# Altium schematic sheet FC_Rev1.0.SchDoc
size A3
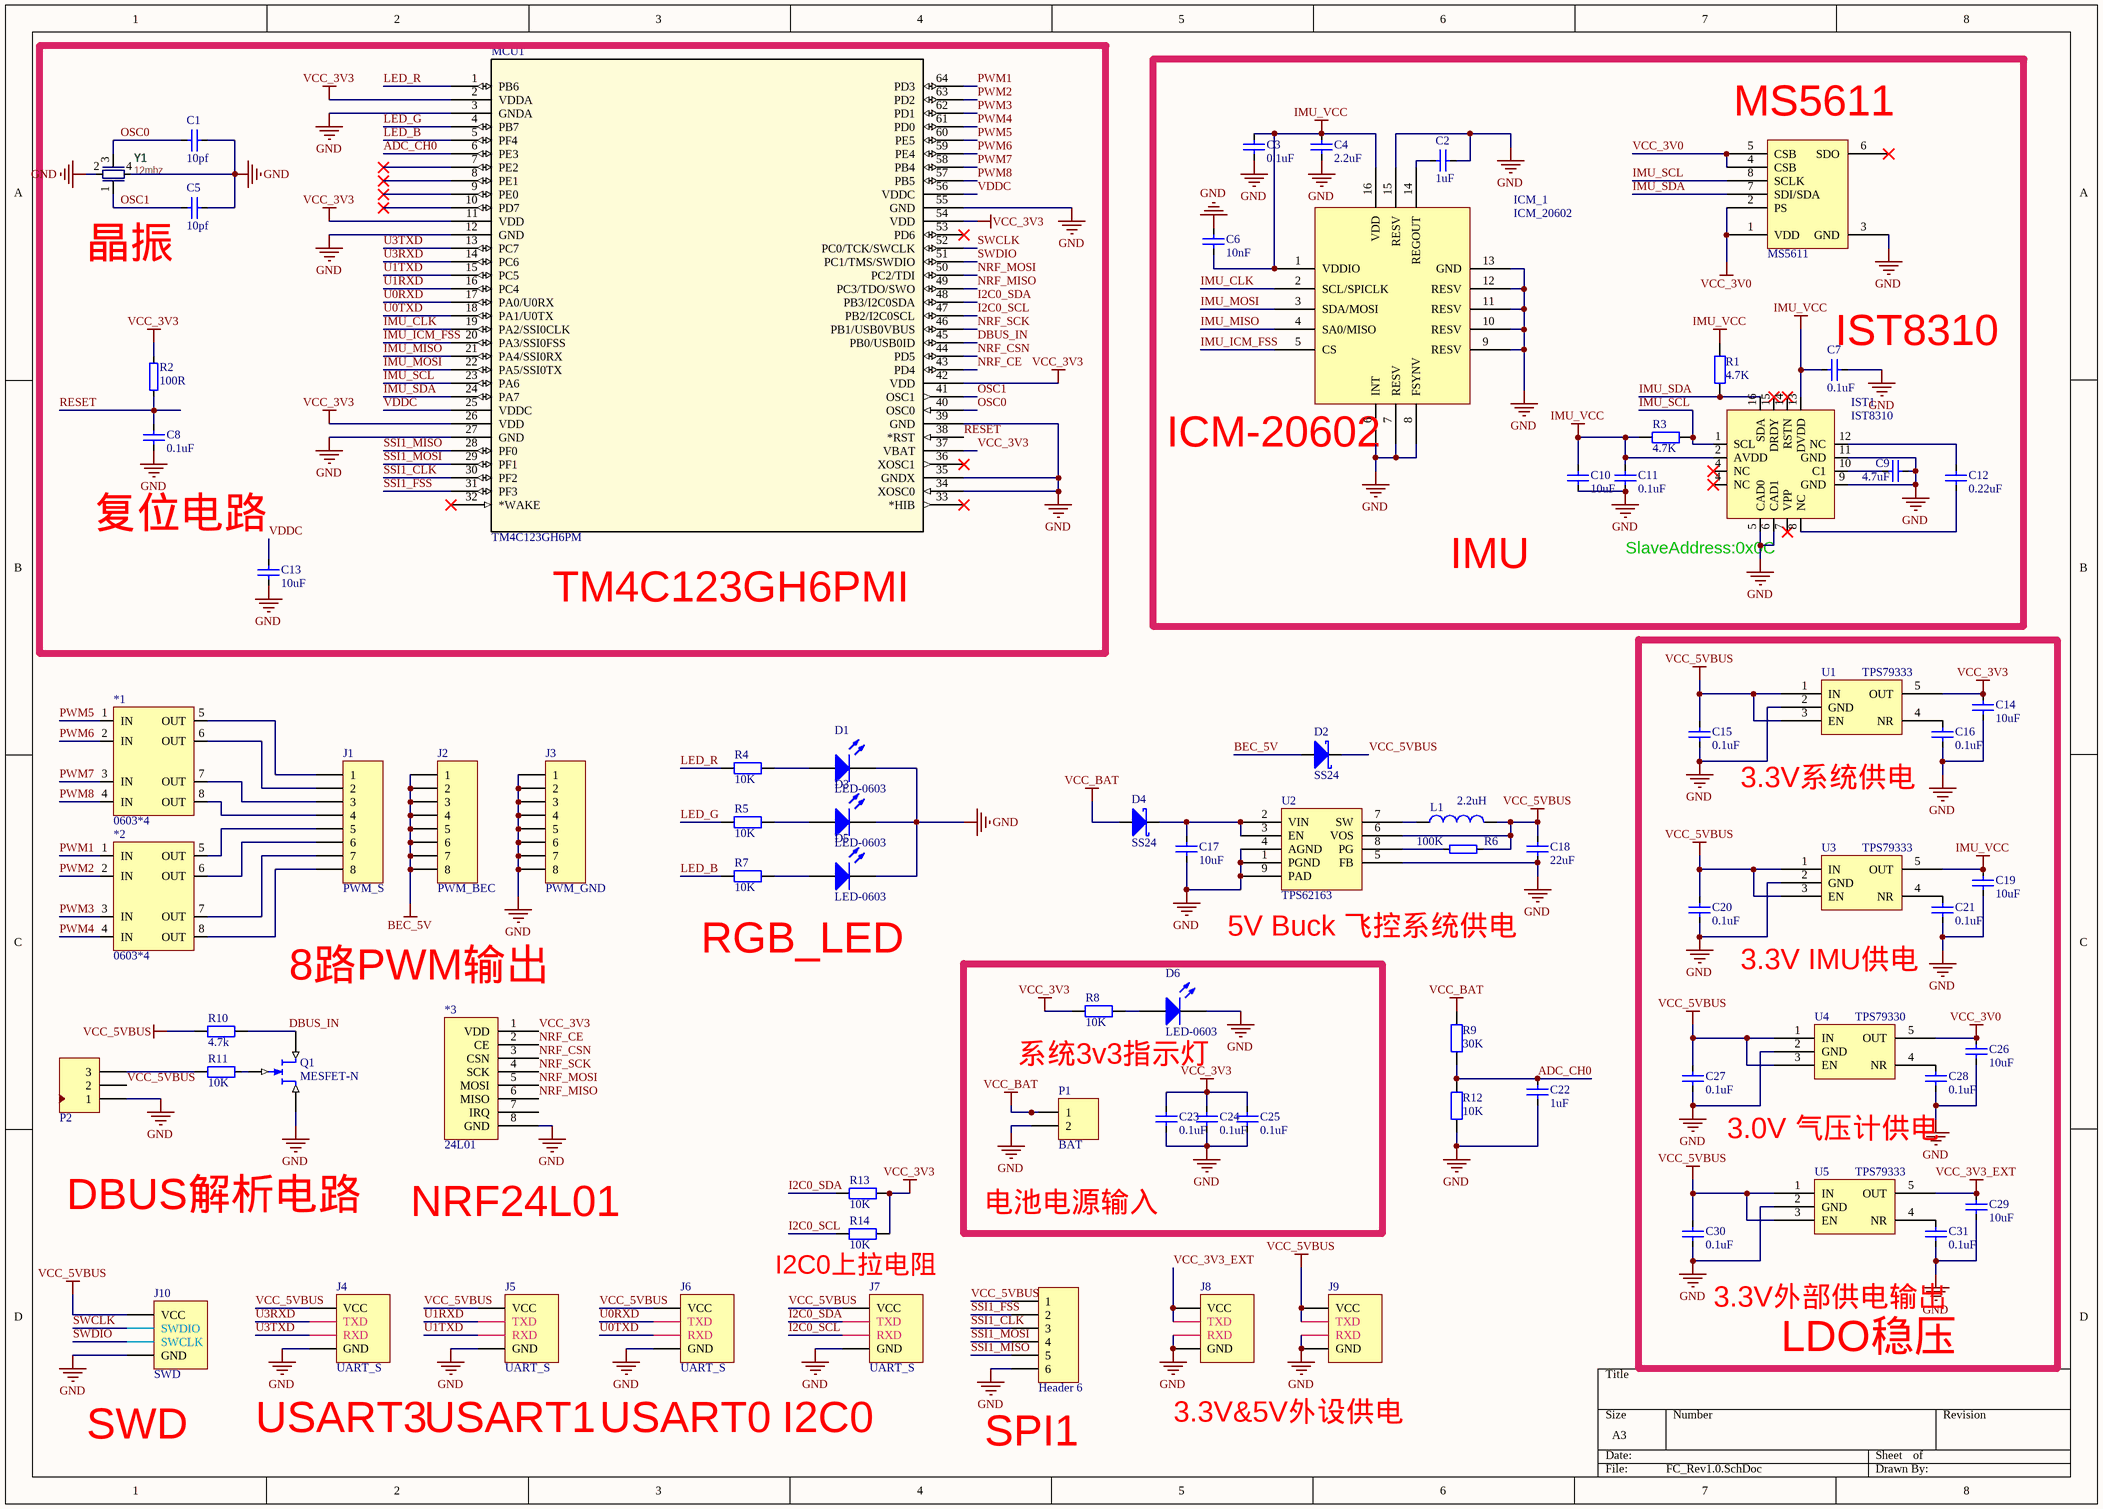
[diagram p0: FC_Rev1.0.SchDoc]

## Parts
*1  0603*4  [0603*4排阻]
*2  0603*4  [0603*4排阻]
*3  24L01  [2.4GModule]
?  Header 6  [SMT1.25_6P-90]
C1  value 10pf  [CAP_0603]  (hidden comment: Cap_0603)
C2  value 1uF  [CAP_0603]  (hidden comment: Cap_0603)
C3  value 0.1uF  [CAP_0603]  (hidden comment: Cap_0603)
C4  value 2.2uF  [CAP_0603]  (hidden comment: Cap_0603)
C5  value 10pf  [CAP_0603]  (hidden comment: Cap_0603)
C6  value 10nF  [CAP_0603]  (hidden comment: Cap_0603)
C7  value 0.1uF  [CAP_0603]  (hidden comment: Cap_0603)
C8  value 0.1uF  [CAP_0603]  (hidden comment: Cap_0603)
C9  value 4.7uF  [CAP_0603]  (hidden comment: Cap_0603)
C10  value 10uF  [CAP_0603]  (hidden comment: Cap_0603)
C11  value 0.1uF  [CAP_0603]  (hidden comment: Cap_0603)
C12  value 0.22uF  [CAP_0603]  (hidden comment: Cap_0603)
C13  value 10uF  [CAP_0603]  (hidden comment: Cap_0603)
C14  value 10uF  [CAP_0603]  (hidden comment: Cap_0603)
C15  value 0.1uF  [CAP_0603]  (hidden comment: Cap_0603)
C16  value 0.1uF  [CAP_0603]  (hidden comment: Cap_0603)
C17  value 10uF  [CAP_0805]  (hidden comment: Cap_0603)
C18  value 22uF  [1206-C]  (hidden comment: Cap_0603)
C19  value 10uF  [CAP_0603]  (hidden comment: Cap_0603)
C20  value 0.1uF  [CAP_0603]  (hidden comment: Cap_0603)
C21  value 0.1uF  [CAP_0603]  (hidden comment: Cap_0603)
C22  value 1uF  [CAP_0603]  (hidden comment: Cap_0603)
C23  value 0.1uF  [CAP_0603]  (hidden comment: Cap_0603)
C24  value 0.1uF  [CAP_0603]  (hidden comment: Cap_0603)
C25  value 0.1uF  [CAP_0603]  (hidden comment: Cap_0603)
C26  value 10uF  [CAP_0603]  (hidden comment: Cap_0603)
C27  value 0.1uF  [CAP_0603]  (hidden comment: Cap_0603)
C28  value 0.1uF  [CAP_0603]  (hidden comment: Cap_0603)
C29  value 10uF  [CAP_0603]  (hidden comment: Cap_0603)
C30  value 0.1uF  [CAP_0603]  (hidden comment: Cap_0603)
C31  value 0.1uF  [CAP_0603]  (hidden comment: Cap_0603)
D1  LED-0603  [LED_0603_RED]
D2  SS24  [DIODE-1206]
D3  LED-0603  [LED_0603_RED]
D4  SS24  [DIODE-1206]
D5  LED-0603  [LED_0603_RED]
D6  LED-0603  [LED_0603_RED]
ICM_1  ICM_20602  [LGA16]
IST1  IST8310  [HMC5983-new]
J1  PWM_S  [HDR1X8]
J2  PWM_BEC  [HDR1X8]
J3  PWM_GND  [HDR1X8]
J4  UART_S  [SMT1.25_4P-90]
J5  UART_S  [SMT1.25_4P-90]
J6  UART_S  [SMT1.25_4P-90]
J7  UART_S  [SMT1.25_4P-90]
J8  (no value)  [SMT1.25_4P-90]
J9  (no value)  [SMT1.25_4P-90]
J10  SWD  [SMT1.25_4P-90]
L1  2.2uH  [2R2_5*5]
MCU1  TM4C123GH6PM  [LQFP64]
MS1  MS5611  [MS5611]
P1  BAT  [HDR1X2]
P2  Header 3  [HDR3X1-2.54]  (value not drawn)
Q1  MESFET-N  [SOT23]
R1  value 4.7K  [0603-R]  (hidden comment: Res_0603)
R2  100R  [0603-R]
R3  value 4.7K  [0603-R]  (hidden comment: Res_0603)
R4  value 10K  [0603-R]  (hidden comment: Res_0603)
R5  value 10K  [0603-R]  (hidden comment: Res_0603)
R6  100K  [0603-R]
R7  value 10K  [0603-R]  (hidden comment: Res_0603)
R8  value 10K  [0603-R]  (hidden comment: Res_0603)
R9  value 30K  [0603-R]  (hidden comment: Res_0603)
R10  value 4.7k  [0603-R]  (hidden comment: Res_0603)
R11  value 10K  [0603-R]  (hidden comment: Res_0603)
R12  value 10K  [0603-R]  (hidden comment: Res_0603)
R13  value 10K  [0603-R]  (hidden comment: Res_0603)
R14  value 10K  [0603-R]  (hidden comment: Res_0603)
U1  TPS79333  [SOT23-5]
U2  TPS62163  [TPS62163DSG]
U3  TPS79333  [SOT23-5]
U4  TPS79330  [SOT23-5]
U5  TPS79333  [SOT23-5]
Y1  12mhz  [3225_new]

## Blocks framed on the sheet
LDO稳压: C14-C16 C19-C21 C26-C31 U1 U3-U5

## Nets
BEC_5V: D2.1(A) J2.1 J2.2 J2.3 J2.4 J2.5 J2.6 J2.7 J2.8
GND: *3.8(GND) ?.6 C1.2 C2.2 C3.2 C4.1 C5.2 C6.2 C7.1 C8.1 C9.1 C10.1 C11.1 C13.1 C14.1 C15.1 C16.1 C17.1 C18.1 C19.1 C20.1 C21.1 C22.1 C23.1 C24.1 C25.1 C26.1 C27.1 C28.1 C29.1 C30.1 C31.1 D1.2(K) D3.2(K) D5.2(K) D6.2(K) ICM_1.6(INT) ICM_1.7(RESV) ICM_1.8(FSYNV) ICM_1.9(RESV) ICM_1.10(RESV) ICM_1.11(RESV) ICM_1.12(RESV) ICM_1.13(GND) ICM_1.15(RESV) IST1.5(CAD0) IST1.6(CAD1) IST1.9(GND) IST1.11(GND) J3.1 J3.2 J3.3 J3.4 J3.5 J3.6 J3.7 J3.8 J4.4(GND) J5.4(GND) J6.4(GND) J7.4(GND) J8.3(RXD) J8.4(GND) J9.3(RXD) J9.4(GND) J10.4(GND) MCU1.3(GNDA) MCU1.12(GND) MCU1.27(GND) MCU1.34(XOSC0) MCU1.35(GNDX) MCU1.39(GND) MCU1.55(GND) MS1.3(GND) P1.2 P2.1 Q1.3(S) R12.1 U1.2(GND) U2.1(PGND) U2.4(AGND) U2.5(FB) U2.9(PAD) U3.2(GND) U4.2(GND) U5.2(GND) Y1.2 Y1.4
IMU_VCC: C3.1 C4.2 C6.1 C7.2 C10.2 C11.2 C19.2 ICM_1.1(VDDIO) ICM_1.16(VDD) IST1.2(AVDD) IST1.13(DVDD) R1.2 R3.1 U3.5(OUT)
VCC_3V0: C26.2 MS1.1(VDD) MS1.2(PS) MS1.4(CSB) MS1.5(CSB) U4.5(OUT)
VCC_3V3: *3.1(VDD) C14.2 C23.2 C24.2 C25.2 MCU1.2(VDDA) MCU1.11(VDD) MCU1.26(VDD) MCU1.37(VBAT) MCU1.42(VDD) MCU1.54(VDD) R2.2 R8.1 R13.2 R14.2 U1.5(OUT)
VCC_3V3_EXT: C29.2 J8.1(VCC) J8.2(TXD) U5.5(OUT)
VCC_5VBUS: ?.1 C15.2 C18.2 C20.2 C27.2 C30.2 D2.2(K) J4.1(VCC) J5.1(VCC) J6.1(VCC) J7.1(VCC) J9.1(VCC) J9.2(TXD) J10.1(VCC) L1.2 P2.2 R6.2 R10.2 U1.1(IN) U1.3(EN) U2.6(VOS) U3.1(IN) U3.3(EN) U4.1(IN) U4.3(EN) U5.1(IN) U5.3(EN)
VCC_BAT: D4.1(A) P1.1 R9.2
ADC_CH0: C22.2 MCU1.6(PE3) R9.1 R12.2
DBUS_IN: MCU1.45(PB0/USB0ID) Q1.1(D) R10.1
I2C0_SCL: J7.3(RXD) MCU1.47(PB2/I2C0SCL) R14.1
I2C0_SDA: J7.2(TXD) MCU1.48(PB3/I2C0SDA) R13.1
IMU_CLK: ICM_1.2(SCL/SPICLK) MCU1.19(PA2/SSI0CLK)
IMU_ICM_FSS: ICM_1.5(CS) MCU1.20(PA3/SSI0FSS)
IMU_MISO: ICM_1.4(SA0/MISO) MCU1.21(PA4/SSI0RX)
IMU_MOSI: ICM_1.3(SDA/MOSI) MCU1.22(PA5/SSI0TX)
IMU_SCL: IST1.1(SCL) MCU1.23(PA6) MS1.8(SCLK) R3.2
IMU_SDA: IST1.16(SDA) MCU1.24(PA7) MS1.7(SDI/SDA) R1.1
LED_B: MCU1.5(PF4) R7.1
LED_G: MCU1.4(PB7) R5.1
LED_R: MCU1.1(PB6) R4.1
NRF_CE: *3.2(CE) MCU1.43(PD4)
NRF_CSN: *3.3(CSN) MCU1.44(PD5)
NRF_MISO: *3.6(MISO) MCU1.49(PC3/TDO/SWO)
NRF_MOSI: *3.5(MOSI) MCU1.50(PC2/TDI)
NRF_SCK: *3.4(SCK) MCU1.46(PB1/USB0VBUS)
OSC0: C1.1 MCU1.40(OSC0) Y1.3
OSC1: C5.1 MCU1.41(OSC1) Y1.1
PWM1: *2.1(IN) MCU1.64(PD3)
PWM2: *2.2(IN) MCU1.63(PD2)
PWM3: *2.3(IN) MCU1.62(PD1)
PWM4: *2.4(IN) MCU1.61(PD0)
PWM5: *1.1(IN) MCU1.60(PE5)
PWM6: *1.2(IN) MCU1.59(PE4)
PWM7: *1.3(IN) MCU1.58(PB4)
PWM8: *1.4(IN) MCU1.57(PB5)
RESET: C8.2 MCU1.38(*RST) R2.1
SSI1_CLK: ?.3 MCU1.30(PF2)
SSI1_FSS: ?.2 MCU1.31(PF3)
SSI1_MISO: ?.5 MCU1.28(PF0)
SSI1_MOSI: ?.4 MCU1.29(PF1)
SWCLK: J10.2(SWDIO) MCU1.52(PC0/TCK/SWCLK)
SWDIO: J10.3(SWCLK) MCU1.51(PC1/TMS/SWDIO)
U0RXD: J6.2(TXD) MCU1.17(PA0/U0RX)
U0TXD: J6.3(RXD) MCU1.18(PA1/U0TX)
U1RXD: J5.2(TXD) MCU1.16(PC4)
U1TXD: J5.3(RXD) MCU1.15(PC5)
U3RXD: J4.2(TXD) MCU1.14(PC6)
U3TXD: J4.3(RXD) MCU1.13(PC7)
VDDC: C13.2 MCU1.25(VDDC) MCU1.56(VDDC)
Net*1_5: *1.5(OUT) J1.1
Net*1_6: *1.6(OUT) J1.2
Net*1_7: *1.7(OUT) J1.3
Net*1_8: *1.8(OUT) J1.4
Net*2_5: *2.5(OUT) J1.5
Net*2_6: *2.6(OUT) J1.6
Net*2_7: *2.7(OUT) J1.7
Net*2_8: *2.8(OUT) J1.8
NetC2_1: C2.1 ICM_1.14(REGOUT)
NetC9_2: C9.2 IST1.10(C1)
NetC12_1: C12.1 IST1.8(NC)
NetC12_2: C12.2 IST1.12(NC)
NetC16_2: C16.2 U1.4(NR)
NetC17_2: C17.2 D4.2(K) U2.2(VIN) U2.3(EN)
NetC21_2: C21.2 U3.4(NR)
NetC28_2: C28.2 U4.4(NR)
NetC31_2: C31.2 U5.4(NR)
NetD1_1: D1.1(A) R4.2
NetD3_1: D3.1(A) R5.2
NetD5_1: D5.1(A) R7.2
NetD6_1: D6.1(A) R8.2
NetL1_1: L1.1 U2.7(SW)
NetP2_3: P2.3 R11.1
NetQ1_2: Q1.2(G) R11.2
NetR6_1: R6.1 U2.8(PG)

Not connected (* = marked no-connect by the designer): *3 7(IRQ); IST1 4(NC)* 7(VPP)* 14(RSTN)* 15(DRDY)*; MCU1 7(PE2)* 8(PE1)* 9(PE0)* 10(PD7)* 32(*WAKE)* 33(*HIB)* 36(XOSC1)* 53(PD6)*; MS1 6(SDO)*

## Notes on the sheet
- (near MS1) MS5611
- 晶振
- (near C7) IST8310
- (near ICM_1) ICM-20602
- (near C8) 复位电路
- IMU
- (near IST1) SlaveAddress:0x0C
- TM4C123GH6PMI
- 3.3V系统供电
- 8路PWM输出
- RGB_LED
- (near U2) 5V Buck 飞控系统供电
- 3.3V IMU供电
- 系统3v3指示灯
- 3.0V 气压计供电
- DBUS解析电路
- NRF24L01
- 电池电源输入
- I2C0上拉电阻
- 3.3V外部供电输出
- (near J10) SWD
- (near J4) USART3
- (near J5) USART1
- (near J6) USART0
- (near J7) I2C0
- SPI1
- 3.3V&5V外设供电

## Library data of the parts
*1 *2 = 0603*4: 0603排阻
? = Header 6: Header, 6-Pin; LatestRevisionDate: 17-Jul-2002; LatestRevisionNote: Re-released for DXP Platform.; Publisher: Altium Limited
C1-C31 = Cap_0603: Capacitor
D2 D4 = SS24: 1N5819,Low-power general purpose voltageregulator diodes in a small plasticSMD SOD323 package; Value: SS24
J1-J3 = Header 8: Header, 8-Pin; LatestRevisionDate: 17-Jul-2002; LatestRevisionNote: Re-released for DXP Platform.; Publisher: Altium Limited
J4-J9 = UART_S: UART,SerialPort,TTL,SLAVE; LatestRevisionDate: 17-Jul-2002; LatestRevisionNote: Re-released for DXP Platform.; Publisher: Altium Limited
J10 = SWD: JLINK,SWD; LatestRevisionDate: 17-Jul-2002; LatestRevisionNote: Re-released for DXP Platform.; Publisher: Altium Limited
L1 = Inductor
P1 = Header 2: Header, 2-Pin; LatestRevisionDate: 17-Jul-2002; LatestRevisionNote: Re-released for DXP Platform.; Publisher: Altium Limited
P2 = Header 3: 接插件; LatestRevisionDate: 17-Jul-2002; LatestRevisionNote: Re-released for DXP Platform.; Publisher: Altium Limited
Q1 = MESFET-N: N-AO_3400a; Published: 8-Jun-2000; LatestRevisionDate: 17-Jul-2002; LatestRevisionNote: Re-released for DXP Platform.; PackageReference: TO-18; Publisher: Altium Limited; PackageDescription: Can; 3 Leads; Pin Circle Dia. 2.54 mm; Lead Dia. 0.48 mm (max); Code_JEDEC: TO-18
R1 R3-R5 R7-R14 = Res_0603: Resistor
R2 R6 = RES: 0603_R
U1 U3 U5 = TPS79330
Y1 = XTAL: =Description